# Altium schematic sheet dnt_mko.SchDoc
size A3; PageSetup: Record=PageOptions|CenterHorizontal=True|CenterVertical=True|PrintScale=1.08|XCorrection=1.00|YCorrection=1.00|PrintKind=0|BorderSize=5000000|LeftOffset=0|BottomOffset=0|Orientation=2|PaperLength=1000|PaperWidth=1000|Scale=100|PaperSource=15|PrintQuality=600|MediaType=1|DitherType=10|PaperKind=Letter (8,5 x 11")|PrintScaleMode=1
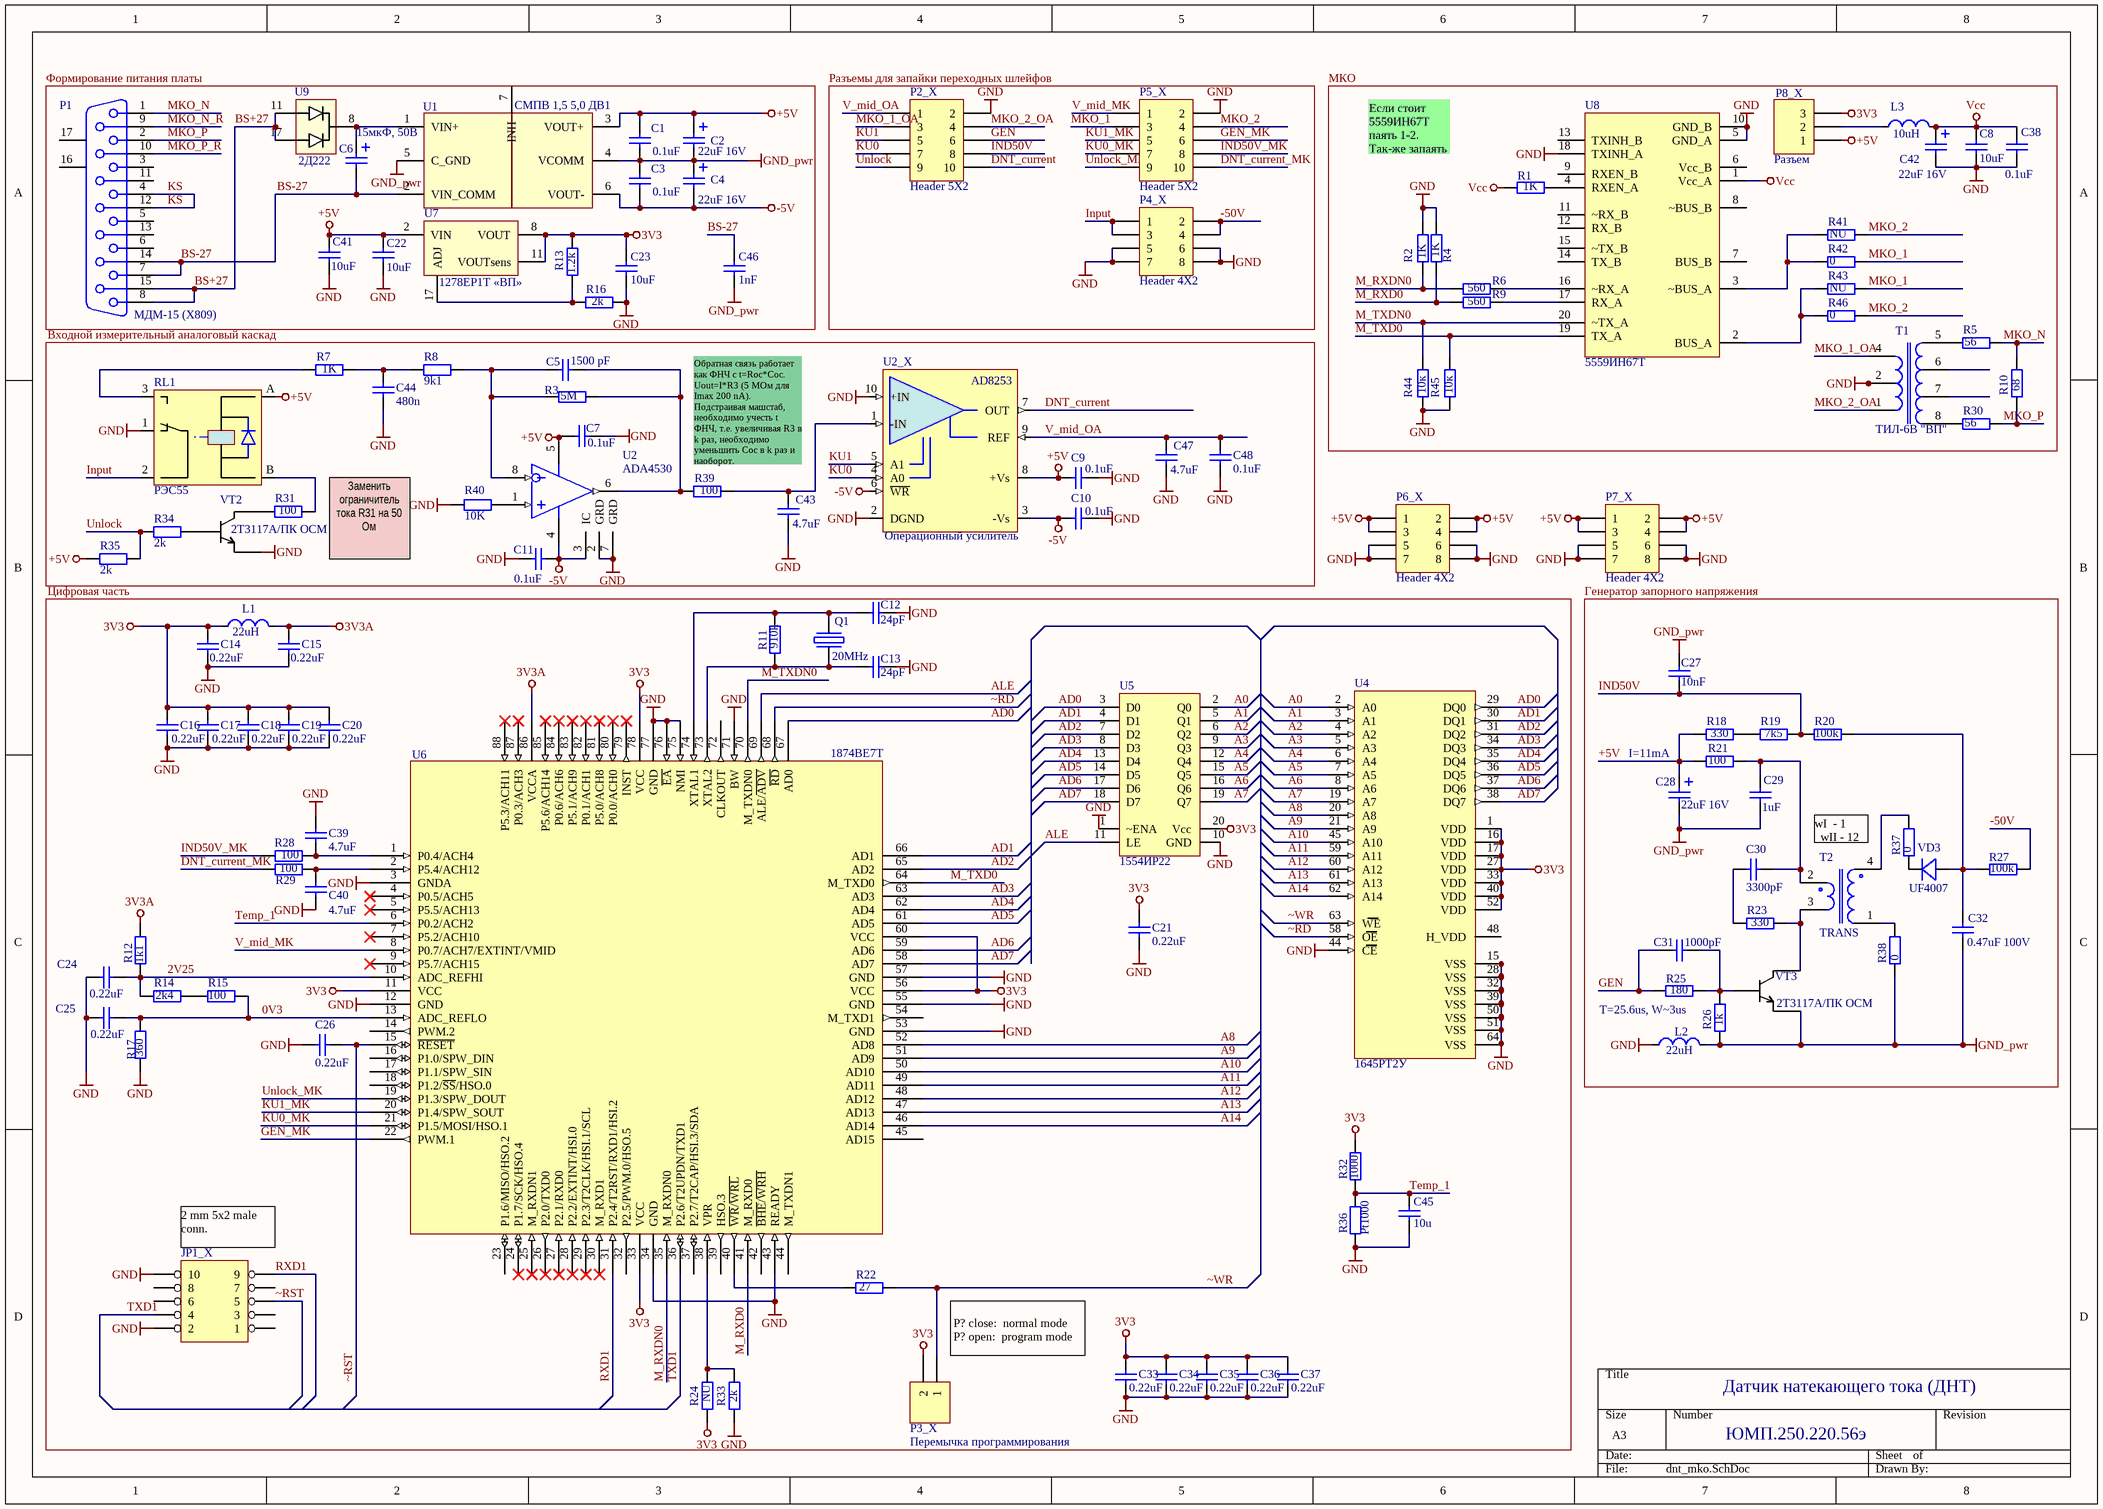
[diagram p0: dnt_mko.SchDoc]

## Parts
C1  0.1uF  [CR-0805]
C2  22uF 16V  [C_SMD_SIZE_B]
C3  0.1uF  [CR-0805]
C4  22uF 16V  [C_SMD_SIZE_B]
C5  1500 pF  [CR-0805]
C6  15мкФ, 50В  [C_SMD_size_D]
C7  0.1uF  [CR-0805]
C8  10uF  [CR-0805]
C9  0.1uF  [CR-0805]
C10  0.1uF  [CR-0805]
C11  0.1uF  [CR-0805]
C12  24pF  [CR-0805]
C13  24pF  [CR-0805]
C14  0.22uF  [CR-0805]
C15  0.22uF  [CR-0805]
C16  0.22uF  [CR-0805]
C17  0.22uF  [CR-0805]
C18  0.22uF  [CR-0805]
C19  0.22uF  [CR-0805]
C20  0.22uF  [CR-0805]
C21  0.22uF  [CR-0805]
C22  10uF  [CR-0805]
C23  10uF  [CR-0805]
C24  0.22uF  [CR-0805]
C25  0.22uF  [CR-0805]
C26  0.22uF  [CR-0805]
C27  10nF  [CR-0805]
C28  22uF 16V  [C_SMD_SIZE_B]
C29  1uF  [CR-0805]
C30  3300pF  [CR-0805]
C31  1000pF  [CR-0805]
C32  0.47uF 100V  [CR-0805]
C33  0.22uF  [CR-0805]
C34  0.22uF  [CR-0805]
C35  0.22uF  [CR-0805]
C36  0.22uF  [CR-0805]
C37  0.22uF  [CR-0805]
C38  0.1uF  [CR-0805]
C39  4.7uF  [CR-0805]
C40  4.7uF  [CR-0805]
C41  10uF  [CR-0805]
C42  22uF 16V  [C_SMD_SIZE_B]
C43  4.7uF  [CR-0805]
C44  480n  [CR-0805]
C45  10u  [CR-0805]
C46  1nF  [CR-1206]
C47  4.7uF  [CR-0805]
C48  0.1uF  [CR-0805]
JP1_X  (no value)  [IDC2-10]
L1  22uH  [C_SMD_SIZE_B]
L2  22uH  [C_SMD_SIZE_B]
L3  10uH  [C_SMD_SIZE_B]
P1  Наименование: МДМ-15 (X809)  [MDM-15]  (hidden comment: MDM-15)
P2_X  Header 5X2  [IDC2-10]
P3_X  Перемычка программирования  [IDC2-2]
P4_X  Header 4X2  [IDC2-8]
P5_X  Header 5X2  [IDC2-10]
P6_X  Header 4X2  [IDC2-8]
P7_X  Header 4X2  [IDC2-8]
P8_X  Разъем  [IDC2-3]
Q1  20MHz  [RK-386MM]
R1  1K  [CR-0805]
R2  1K  [CR-0805]
R3  5M  [CR-1206]
R4  1K  [CR-0805]
R5  56  [CR-1206]
R6  560  [CR-0805]
R7  1K  [CR-0805]
R8  9k1  [CR-0805]
R9  560  [CR-0805]
R10  68  [CR-1206]
R11  910k  [CR-0805]
R12  1k1  [CR-0805]
R13  1.2k  [CR-0805]
R14  2k4  [CR-0805]
R15  100  [CR-0805]
R16  2k  [CR-0805]
R17  360  [CR-0805]
R18  330  [CR-0805]
R19  7k5  [CR-0805]
R20  100k  [CR-0805]
R21  100  [CR-0805]
R22  27  [CR-0805]
R23  330  [CR-0805]
R24  NU  [CR-0805]
R25  180  [CR-0805]
R26  1k  [CR-0805]
R27  100k  [CR-0805]
R28  100  [CR-0805]
R29  100  [CR-0805]
R30  56  [CR-1206]
R31  100  [CR-0805]
R32  1000  [CR-0805]
R33  2k  [CR-0805]
R34  2k  [CR-0805]
R35  2k  [CR-0805]
R36  Pt1000  [Pt100]
R37  0  [CR-0805]
R38  0  [CR-0805]
R39  100  [CR-0805]
R40  10K  [CR-0805]
R41  NU  [CR-0805]
R42  0  [CR-0805]
R43  NU  [CR-0805]
R44  10к  [CR-0805]
R45  10к  [CR-0805]
R46  0  [CR-0805]
RL1  РЭС55  [РЭС55]
T1  ТИЛ-6В "ВП"  [ТИЛ6В]
T2  TRANS  [TRANS 50V]
U1  СМПВ 1,5 5,0 ДВ1  [SLH 2805]
U2  ADA4530  [SO-8]
U2_X  Назначение: Операционный усилитель  [u_SO-10]  (hidden comment: AD8253)
U4  1645РТ2У  [5134.64-6]
U5  1554ИР22  [20PIN FLATPACK]
U6  1874BE7T  [4235.88-1]
U7  1278ЕР1Т «ВП»  [1278ЕР1Т - БУ]
U8  5559ИН67Т  [20PIN FLATPACK]
U9  Наименование: 2Д222  [1278ЕР1Т - БУ]  (hidden comment: 2D222)
VD3  UF4007  [AXIAL-0.4]
VT2  2Т3117А/ПК ОСМ  [2Д3117А]
VT3  2Т3117А/ПК ОСМ  [2Д3117А]

## Nets
3V3: C14.2 C16.2 C17.2 C18.2 C19.2 C20.2 C21.1 C23.1 C33.2 C34.2 C35.2 C36.2 C37.2 L1.1 P3_X.2 P8_X.3 R13.1 R24.1 R32.2 U4.1(VDD) U4.16(VDD) U4.17(VDD) U4.27(VDD) U4.33(VDD) U4.40(VDD) U4.52(VDD) U5.20(Vcc) U6.11(VCC) U6.33(VCC) U6.56(VCC) U6.60(VCC) U6.78(VCC) U7.8(VOUT) U7.11(VOUTsens)
3V3A: C15.2 L1.2 R12.1 U6.86(VCCA)
+5V: C1.2 C2.1 C7.1 C9.1 C22.1 C28.1 C41.1 P6_X.1 P6_X.2 P6_X.3 P6_X.4 P7_X.1 P7_X.2 P7_X.3 P7_X.4 P8_X.1 R18.1 R21.1 R35.1 RL1.A U1.3(VOUT+) U2.5(V+) U2_X.8(+Vs) U7.2(VIN)
-5V: C3.1 C4.2 C10.1 C11.2 U1.6(VOUT-) U2.3(IC) U2.4(V-) U2_X.3(-Vs) U2_X.6(~{WR})
GND: C7.2 C8.1 C9.2 C10.2 C11.1 C12.1 C13.1 C14.1 C15.1 C16.1 C17.1 C18.1 C19.1 C20.1 C21.2 C22.2 C23.2 C24.2 C25.2 C26.2 C33.1 C34.1 C35.1 C36.1 C37.1 C38.1 C39.1 C40.2 C41.2 C42.2 C43.1 C44.1 C45.2 C47.1 C48.2 JP1_X.2 JP1_X.10 L2.1 P2_X.2 P4_X.5 P4_X.6 P4_X.7 P4_X.8 P5_X.2 P6_X.5 P6_X.6 P6_X.7 P6_X.8 P7_X.5 P7_X.6 P7_X.7 P7_X.8 R2.1 R4.1 R16.1 R17.2 R33.1 R36.1 R40.2 R44.2 R45.2 RL1.1 T1.2(2,3) T1.3 U2.2(GRD) U2.7(GRD) U2_X.2(DGND) U2_X.10(+IN) U4.15(VSS) U4.28(VSS) U4.32(VSS) U4.39(VSS) U4.44(CE) U4.50(VSS) U4.51(VSS) U5.1(~ENA) U5.10(GND) U6.3(GNDA) U6.12(GND) U6.34(GND) U6.43(READY) U6.53(GND) U6.55(GND) U6.57(GND) U6.71(BW) U6.75(NMI) U6.76(~{EA}) U6.77(GND) U8.5(GND_A) U8.10(GND_B) U8.18(TXINH_A) VT2.1(EMMITOR)
GND_pwr: C1.1 C2.2 C3.2 C4.1 C27.1 C28.2 C29.2 C32.1 C46.2 L2.2 R26.1 R38.1 U1.4(VCOMM) U1.5(C_GND) VT3.1(EMMITOR)
Vcc: C8.2 C38.2 C42.1 L3.2 R1.2 U8.1(Vcc_A)
0V3: C25.1 R15.2 R17.1 U6.13(ADC_REFLO)
2V25: C24.1 R12.2 R14.1 U6.10(ADC_REFHI)
-50V: P4_X.2 P4_X.4 R27.1
A0: U4.2(A0) U5.2(Q0)
A1: U4.3(A1) U5.5(Q1)
A2: U4.4(A2) U5.6(Q2)
A3: U4.5(A3) U5.9(Q3)
A4: U4.6(A4) U5.12(Q4)
A5: U4.7(A5) U5.15(Q5)
A6: U4.8(A6) U5.16(Q6)
A7: U4.19(A7) U5.19(Q7)
A8: U4.20(A8) U6.52(AD8)
A9: U4.21(A9) U6.51(AD9)
A10: U4.45(A10) U6.50(AD10)
A11: U4.59(A11) U6.49(AD11)
A12: U4.60(A12) U6.48(AD12)
A13: U4.61(A13) U6.47(AD13)
A14: U4.62(A14) U6.46(AD14)
AD0: U4.29(DQ0) U5.3(D0) U6.67(AD0)
AD1: U4.30(DQ1) U5.4(D1) U6.66(AD1)
AD2: U4.31(DQ2) U5.7(D2) U6.65(AD2)
AD3: U4.34(DQ3) U5.8(D3) U6.63(AD3)
AD4: U4.35(DQ4) U5.13(D4) U6.62(AD4)
AD5: U4.36(DQ5) U5.14(D5) U6.61(AD5)
AD6: U4.37(DQ6) U5.17(D6) U6.59(AD6)
AD7: U4.38(DQ7) U5.18(D7) U6.58(AD7)
ALE: U5.11(LE) U6.69(ALE/~{ADV})
BS+27: P1.8 P1.15 U9.11 U9.17
BS-27: C6.2 C46.1 P1.7 P1.14 U1.2(VIN_COMM)
DNT_current: P2_X.10 U2_X.7(OUT)
DNT_current_MK: P5_X.10 R29.1
GEN: C31.2 P2_X.6 R25.1
GEN_MK: P5_X.6 U6.22(PWM.1)
IND50V: C27.2 P2_X.8 R19.2 R20.1
IND50V_MK: P5_X.8 R28.1
Input: P4_X.1 P4_X.3 RL1.2
KS: P1.4 P1.12
KU0: P2_X.7 U2_X.4(A0)
KU0_MK: P5_X.7 U6.21(P1.5/MOSI/HSO.1)
KU1: P2_X.5 U2_X.5(A1)
KU1_MK: P5_X.5 U6.20(P1.4/SPW_SOUT)
M_RXD0: R4.2 R9.1 U6.41(M_RXD0)
M_RXDN0: R2.2 R6.1 U6.35(M_RXDN0)
M_TXD0: R45.1 U6.64(M_TXD0) U8.19(TX_A)
M_TXDN0: R44.1 U6.70(M_TXDN0) U8.20(~TX_A)
MKO_1: P5_X.3 R42.2 R43.2
MKO_1_OA: P2_X.3 T1.4
MKO_2: P5_X.4 R41.2 R46.2
MKO_2_OA: P2_X.4 T1.1
MKO_N: P1.1 R5.2 R10.2
MKO_N_R: P1.9
MKO_P: P1.2 R10.1 R30.2
MKO_P_R: P1.10
RXD1: JP1_X.9 U6.31(P2.4/T2RST/RXD1/HSI.2)
Temp_1: C45.1 R32.1 R36.2 U6.6(P0.2/ACH2)
TXD1: JP1_X.4 U6.36(P2.6/T2UPDN/TXD1)
Unlock: P2_X.9 R34.2 R35.2
Unlock_MK: P5_X.9 U6.19(P1.3/SPW_DOUT)
V_mid_MK: P5_X.1 U6.8(P0.7/ACH7/EXTINT/VMID)
V_mid_OA: C47.2 C48.1 P2_X.1 U2_X.9(REF)
~RD: U4.58(OE) U6.68(~{RD})
~RST: C26.1 JP1_X.5 U6.15(~{RESET})
~WR: P3_X.1 R22.2 U4.63(WE)
NetC5_1: C5.1 R3.2 R39.2 U2.6(OUT)
NetC5_2: C5.2 R3.1 R8.2 U2.8(IN-)
NetC6_1: C6.1 U1.1(VIN+) U9.8
NetC12_2: C12.2 Q1.1 R11.2 U6.74(XTAL1)
NetC13_2: C13.2 Q1.2 R11.1 U6.73(XTAL2)
NetC29_1: C29.1 C30.1 R21.2 T2.2
NetC30_2: C30.2 R23.1
NetC31_1: C31.1 R25.2 R26.2 VT3.2(BASE)
NetC32_2: C32.2 R20.2 R27.2 VD3.1(A)
NetC39_2: C39.2 R28.2 U6.1(P0.4/ACH4)
NetC40_1: C40.1 R29.2 U6.2(P5.4/ACH12)
NetC43_2: C43.2 R39.1 U2_X.1(-IN)
NetC44_2: C44.2 R7.1 R8.1
NetL3_1: L3.1 P8_X.2
NetR1_1: R1.1 U8.4(RXEN_A)
NetR5_1: R5.1 T1.5
NetR6_2: R6.2 U8.16(~RX_A)
NetR7_2: R7.2 RL1.3
NetR9_2: R9.2 U8.17(RX_A)
NetR13_2: R13.2 R16.2 U7.17(ADJ)
NetR14_2: R14.2 R15.1
NetR18_2: R18.2 R19.1
NetR22_1: R22.1 U6.40(~{WR}/~{WRL})
NetR23_2: R23.2 T2.3 VT3.3(KOLLECTOR)
NetR24_2: R24.2 R33.2 U6.38(VPR)
NetR30_1: R30.1 T1.8
NetR31_1: R31.1 RL1.B
NetR31_2: R31.2 VT2.3(KOLLECTOR)
NetR34_1: R34.1 VT2.2(BASE)
NetR37_1: R37.1 VD3.2(K)
NetR37_2: R37.2 T2.4
NetR38_2: R38.2 T2.1
NetR40_1: R40.1 U2.1(IN+)
NetR41_1: R41.1 R42.1 U8.3(~BUS_A)
NetR43_1: R43.1 R46.1 U8.2(BUS_A)

Not connected (* = marked no-connect by the designer): JP1_X 1 3 6 7 8; P1 3 5 6 11 13 16(MH1) 17(MH2); T1 6 7; U1 7(INH); U4 48(H_VDD) 64(VSS); U6 4(P0.5/ACH5)* 5(P5.5/ACH13)* 7(P5.2/ACH10)* 9(P5.7/ACH15)* 14(PWM.2) 16(P1.0/SPW_DIN) 17(P1.1/SPW_SIN) 18(P1.2/~{SS}/HSO.0) 23(P1.6/MISO/HSO.2) 24(P1.7/SCK/HSO.4)* 25(M_RXDN1)* 26(P2.0/TXD0)* 27(P2.1/RXD0)* 28(P2.2/EXTINT/HSI.0)* 29(P2.3/T2CLK/HSI.1/SCL)* 30(M_RXD1)* 32(P2.5/PWM.0/HSO.5) 37(P2.7/T2CAP/HSI.3/SDA) 39(HSO.3) 42(~{BHE}/~{WRH}) 44(M_TXDN1) 45(AD15) 54(M_TXD1) 72(CLKOUT) 79(INST)* 80(P0.0/ACH0)* 81(P5.0/ACH8)* 82(P0.1/ACH1)* 83(P5.1/ACH9)* 84(P0.6/ACH6)* 85(P5.6/ACH14)* 87(P0.3/ACH3)* 88(P5.3/ACH11)*; U8 6(Vcc_B) 7(BUS_B) 8(~BUS_B) 9(RXEN_B) 11(~RX_B) 12(RX_B) 13(TXINH_B) 14(TX_B) 15(~TX_B)

## Notes on the sheet
- Если стоит 5559ИН67Т паять 1-2.
  Так-же запаять нижнее плечо делителей.
- Обратная связь работает как ФНЧ с t=Rос*Cос. Uout=I*R3 (5 МОм для Imax 200 nA). Подстраивая машстаб, необходимо учесть t ФНЧ, т.е. увеличивая R3 в k раз, необходимо уменьшить Cос в k раз и наоборот.
- (near R31) Заменить ограничитель тока R31 на 50 Ом
- I=11mA
- wI  - 1
  wII - 12
- (near R25) T=25.6us, W~3us
- (near JP1_X) 2 mm 5x2 male conn.
- P? close:  normal mode
  P? open:  program mode
- Датчик натекающего тока (ДНТ)
- ЮМП.250.220.56э
- Labels drawn without touching a wire or pin: Входной измерительный аналоговый каскад, Генератор запорного напряжения, МКО, Разъемы для запайки переходных шлейфов, Формирование питания платы, Цифровая часть

## Library data of the parts
C1 C3 C12-C27 C29-C37 C39-C41 C45 C46 = C: Capacitor; Назначение: Конденсатор керамический; Наименование: К10-79 МП0 «ВП»; Published: 8-Jun-2000; Revision: July-2002: Re-released for DXP Platform.; Publisher: Altium Limited
  C1 C3: Value: 0.1uF
  C12 C13: Value: 24pF
  C14-C21 C24-C26 C33-C37: Value: 0.22uF
  C22 C23 C41: Value: 10uF
  C27: Value: 10nF
  C29: Value: 1uF
  C30: Value: 3300pF
  C31: Value: 1000pF
  C32: Value: 0.47uF 100V
  C39 C40: Value: 4.7uF
  C45: Value: 10u
  C46: Value: 1nF
C2 C4 C6 C28 C42 = C_pol: Capacitor; Назначение: Конденсатор танталовый; Наименование: К53-68 «ВП»; Published: 8-Jun-2000; Revision: July-2002: Re-released for DXP Platform.; Publisher: Altium Limited
  C2 C4 C28 C42: Value: 22uF 16V
  C6: Value: 15мкФ, 50В
C5 C7-C11 C38 C43 C44 C47 C48 = C: Capacitor; Назначение: Конденсатор керамический; Наименование: К10-79 МП0 "ВП"; Published: 8-Jun-2000; Revision: July-2002: Re-released for DXP Platform.; Publisher: Altium Limited
  C5: Value: 1500 pF
  C7 C9-C11 C38 C48: Value: 0.1uF
  C8: Value: 10uF
  C43 C47: Value: 4.7uF
  C44: Value: 480n
JP1_X = HEADER 5X2
L1-L3 = INDUCTOR: Назначение: Индуктивность; Наименование: Индуктивность
  L1 L2: Value: 22uH
  L3: Value: 10uH
P1 = D Connector 15: Receptacle Assembly, 15 Position, Right Angle; Назначение: Разъем
P2_X P5_X = Header 5X2: Header, 5-Pin, Dual row; LatestRevisionDate: 17-Jul-2002; LatestRevisionNote: Re-released for DXP Platform.; Publisher: Altium Limited
P3_X = Header 2: Header, 2-Pin; Назначение: Перемычка программирования; Наименование: Перемычка программирования
P4_X P6_X P7_X = Header 4X2: Header, 4-Pin, Dual row; LatestRevisionDate: 17-Jul-2002; LatestRevisionNote: Re-released for DXP Platform.; Publisher: Altium Limited
P8_X = Header 3: Header, 3-Pin; Назначение: Разъем для выбора питания; LatestRevisionDate: 17-Jul-2002; LatestRevisionNote: Re-released for DXP Platform.; Publisher: Altium Limited; Наименование: Разъем
Q1 = QUARZ: Resonator; Наименование: РК-386ММ-4ДР-20000КГЦ-ПМИ; Назначение: Кварцевый резонатор
R1-R35 R37-R46 = R: Resistor; Назначение: ЧИП-резистор; Наименование: Р1-12-0.125 ОСМ; Revision: July-2002: Re-released for DXP Platform.
  R1 R2 R4 R7: Published: 8-Jun-2000; Publisher: Altium Limited; Value: 1K
  R3: Value: 5M
  R5 R30: Published: 8-Jun-2000; Publisher: Altium Limited; Value: 56
  R6 R9: Published: 8-Jun-2000; Publisher: Altium Limited; Value: 560
  R8: Published: 8-Jun-2000; Publisher: Altium Limited; Value: 9k1
  R10: Published: 8-Jun-2000; Publisher: Altium Limited; Value: 68
  R11: Published: 8-Jun-2000; Publisher: Altium Limited; Value: 910k
  R12: Published: 8-Jun-2000; Publisher: Altium Limited; Value: 1k1
  R13: Published: 8-Jun-2000; Publisher: Altium Limited; Value: 1.2k
  R14: Published: 8-Jun-2000; Publisher: Altium Limited; Value: 2k4
  R15 R21 R28 R29 R31 R39: Published: 8-Jun-2000; Publisher: Altium Limited; Value: 100
  R16 R33-R35: Published: 8-Jun-2000; Publisher: Altium Limited; Value: 2k
  R17: Published: 8-Jun-2000; Publisher: Altium Limited; Value: 360
  R18 R23: Published: 8-Jun-2000; Publisher: Altium Limited; Value: 330
  R19: Published: 8-Jun-2000; Publisher: Altium Limited; Value: 7k5
  R20 R27: Published: 8-Jun-2000; Publisher: Altium Limited; Value: 100k
  R22: Published: 8-Jun-2000; Publisher: Altium Limited; Value: 27
  R24 R41 R43: Published: 8-Jun-2000; Publisher: Altium Limited; Value: NU
  R25: Published: 8-Jun-2000; Publisher: Altium Limited; Value: 180
  R26: Published: 8-Jun-2000; Publisher: Altium Limited; Value: 1k
  R32: Published: 8-Jun-2000; Publisher: Altium Limited; Value: 1000
  R37 R38 R42 R46: Published: 8-Jun-2000; Publisher: Altium Limited; Value: 0
  R40: Published: 8-Jun-2000; Publisher: Altium Limited; Value: 10K
  R44 R45: Published: 8-Jun-2000; Publisher: Altium Limited; Value: 10к
R36 = R: Resistor; Value: 1000; Назначение: Терморезистор; Published: 8-Jun-2000; Revision: July-2002: Re-released for DXP Platform.; Publisher: Altium Limited; Наименование: Pt1000
RL1 = RGK-56: Реле; Назначение: Реле
T1 = TIL6B: Transformator; Назначение: Трансформатор МКО; Наименование: ТИЛ-6В "ВП"
T2 = TRANS: Transformer; Назначение: Трансформатор; Наименование: Трансформатор
U1 = SLH2805: Назначение: DC-DC преобразователь; Наименование: СМПВ 1,5 5,0 ДВ1
U2 = ADA4530: Ultra-Low Bias Current Difet OpAmp; Назначение: Операционный усилитель; Наименование: ADA4530
U2_X = AD8251: 10 MHz, 20 V/мs, G = 1, 2, 4, 8 iCMOS Programmable Gain Instrumentation Amplifier; Наименование: AD8253
U4 = 1645РТ2У: Назначение: ОППЗУ; Наименование: 1645РТ2У
U5 = 1554ИР22: Назначение: Восьмиразрядный регистр; Наименование: 1554ИР22ТБМ
U6 = 1874BE7T: Microcontroller; Назначение: Микроконтроллер; Наименование: 1874BE7T
U7 = 1278ER1T VP: Назначение: Линейный регулятор; Наименование: 1278ЕР1Т "ВП"
U8 = 5559ИН67Т: Назначение: Приемопередатчик манчестерского кода; Наименование: 5559ИН67Т
U9 = 2D222: Назанчение: Сдвоенный диод
VD3 = DIODE: Назначение: Диод; Наименование: UF4007
VT2 VT3 = 2T3117A: Назначение: Транзистор; Наименование: 2Т3117А/ПК ОСМ